# Altium schematic sheet insulation-monitoring.SchDoc
size A3; DocumentNumber: 18; SheetNumber: 18; SheetTotal: 45; SheetDescription: Insulation Monitoring Interface
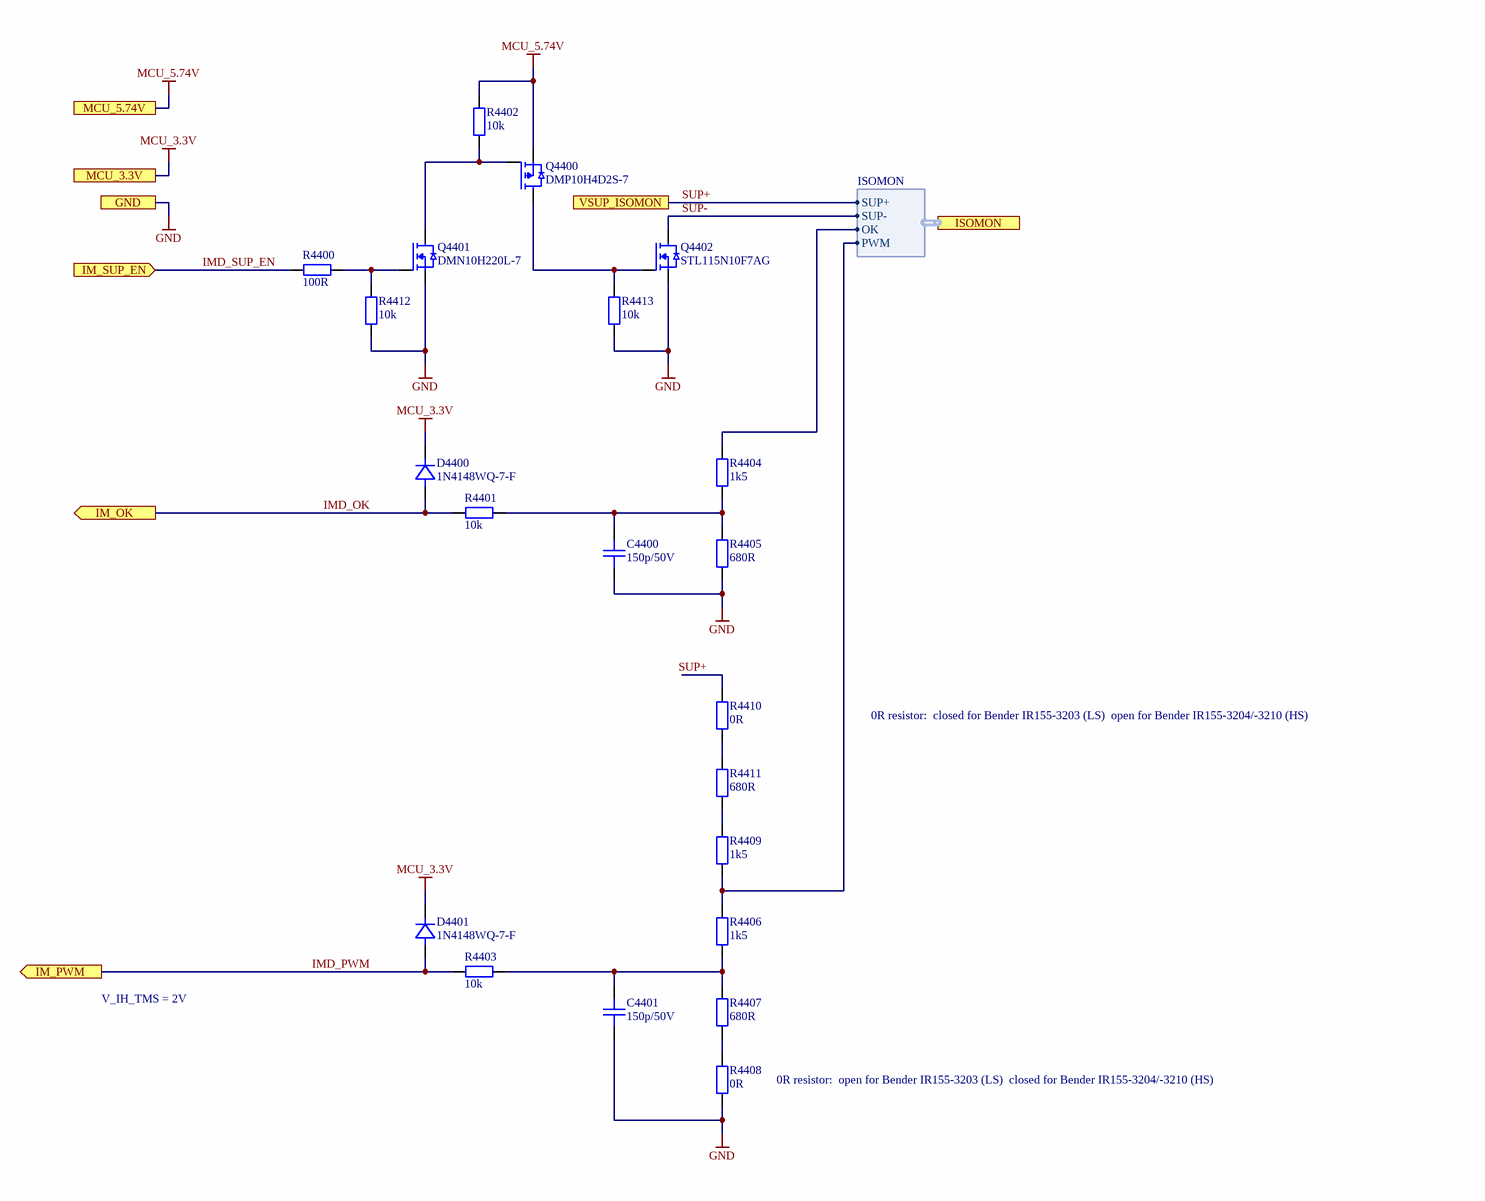
[diagram p0: insulation-monitoring.SchDoc]

## Parts
C4400  150p/50V  [CAPC1005X06N]
C4401  150p/50V  [CAPC1005X06N]
D4400  1N4148WQ-7-F  [SOD-123_CASE-425-04-ISSUE-G]
D4401  1N4148WQ-7-F  [SOD-123_CASE-425-04-ISSUE-G]
Q4400  DMP10H4D2S-7  [SOT95P237X110-3N]
Q4401  DMN10H220L-7  [SOT95P237X110-3N]
Q4402  STL115N10F7AG  [ST_PowerFLAT_5x6_WF_type_C]
R4400  100R  [RESC1005X04N]
R4401  10k  [RESC1005X04N]
R4402  10k  [RESC1005X04N]
R4403  10k  [RESC1005X04N]
R4404  1k5  [RESC1005X04N]
R4405  680R  [RESC1005X04N]
R4406  1k5  [RESC1005X04N]
R4407  680R  [RESC1005X04N]
R4408  0R  [RESC1005X04N]
R4409  1k5  [RESC1005X04N]
R4410  0R  [RESC1005X04N]
R4411  680R  [RESC1005X04N]
R4412  10k  [RESC1005X04N]
R4413  10k  [RESC1005X04N]

## Ports
GND, IM_OK (out), IM_PWM (out), IM_SUP_EN (in), ISOMON (harness ISOMON), MCU_3.3V, MCU_5.74V, VSUP_ISOMON

## Harnesses
ISOMON: SUP+, SUP-, OK, PWM

## Nets
GND: C4400.1 C4401.1 Q4401.S Q4402.S R4405.1 R4408.1 R4412.1 R4413.1 ; port GND
MCU_3.3V: D4400.1(K) D4401.1(K) ; port MCU_3.3V
MCU_5.74V: Q4400.S R4402.2 ; port MCU_5.74V
IMD_OK: D4400.2(A) R4401.2 ; port IM_OK
IMD_PWM: D4401.2(A) R4403.2 ; port IM_PWM
IMD_SUP_EN: R4400.1 ; port IM_SUP_EN
SUP+: R4410.2 ; port VSUP_ISOMON, port ISOMON.SUP+
SUP-: Q4402.D ; port ISOMON.SUP-
NetC4400_2: C4400.2 R4401.1 R4404.1 R4405.2
NetC4401_2: C4401.2 R4403.1 R4406.1 R4407.2
NetQ4400_D: Q4400.D Q4402.G R4413.2
NetQ4400_G: Q4400.G Q4401.D R4402.1
NetQ4401_G: Q4401.G R4400.2 R4412.2
NetR4404_2: R4404.2 ; port ISOMON.OK
NetR4406_2: R4406.2 R4409.1 ; port ISOMON.PWM
NetR4407_1: R4407.1 R4408.2
NetR4409_2: R4409.2 R4411.2
NetR4410_1: R4410.1 R4411.1

## Notes on the sheet
- 0R resistor:
  closed for Bender IR155-3203 (LS)
  open for Bender IR155-3204/-3210 (HS)
- V_IH_TMS = 2V
- 0R resistor:
  open for Bender IR155-3203 (LS)
  closed for Bender IR155-3204/-3210 (HS)
- Fraunhofer IISB
- Schottkystr. 10
- developed by:
- 91058 Erlangen
- Germany
- Author
- Project
- License
- Description
- File
- Version
- Release Date
- Sheet
- foxbms.org <https://foxbms.org>
- www.iisb.fraunhofer.de <https://www.iisb.fraunhofer.de/>
- foxBMS Team
- /

## Library data of the parts
C4400 C4401 = gen_C_ceramic_150p_50V_C0G_0402: MLCC; Capacitance: 150p; Rated Voltage: 50V; Dielectric: C0G; Case EIA: 0402; Case Metric: 1005; Automotive Qualified: True; PnP Package: 0402C; Part Number: gen_C_ceramic_150p_50V_C0G_0402; Supplier 1: Digikey; Supplier Part Number 1: 490-4926-1-ND
D4400 D4401 = 1N4148WQ-7-F: Diode; Manufacturer: Diodes Inc.; Breakdown Voltage: 100V; Continuous Forward Current: 300mA; PnP Package: SOD123; Automotive Qualified: True; Part Number: 1N4148WQ-7-F; Part Name: 1N4148WQ-7-F; Operating Temperature: -65°C - +150°C; ComponentLink1Description: Datasheet; ComponentLink1URL: https://www.diodes.com/assets/Datasheets/ds30086.pdf; Supplier 1: Digikey; Supplier Part Number 1: 1N4148WQ-7-FDICT-ND
Q4400 = DMP10H4D2S-7: MOSFET-Transistor, p-Kanal, 0.27 A, 100 V, 4.2 ohm; Manufacturer: Diodes; Maximum Drain-Source Voltage: 100V; Maximum Continous Drain Current (25°C): 0.27A; R_DS(on): 4.2; Total Gate Charge: 1.8nC; Automotive Qualified: True; Part Number: DMP10H4D2S-7; Part Name: PMOS; Operating Temperature: -55°C - +150°C; ComponentLink1Description: Datasheet; ComponentLink1URL: https://www.diodes.com/assets/Datasheets/DMP10H4D2S.pdf; Supplier 1: Farnell; Supplier Part Number 1: 3127354; Supplier 2: Digikey; Supplier Part Number 2: DMP10H4D2S-7DICT-ND; Supplier 3: Mouser; Supplier Part Number 3: 621-DMP10H4D2S-7
Q4401 = DMN10H220L-7: MOSFET-Transistor, n-Kanal, 1.6 A, 100 V, 0.250 ohm; Manufacturer: Diodes; Maximum Drain-Source Voltage: 100V; Maximum Continous Drain Current (25°C): 1.6A; R_DS(on): 250m; Total Gate Charge: 4.1nC; Automotive Qualified: True; Part Number: DMN10H220L-7; Part Name: NMOS; Operating Temperature: -55°C - +150°C; ComponentLink1Description: Datasheet; ComponentLink1URL: https://www.diodes.com/assets/Datasheets/DMN10H220L.pdf; Supplier 1: Digikey; Supplier Part Number 1: DMN10H220L-7DICT-ND; Supplier 2: Farnell; Supplier 3: Mouser; Supplier Part Number 2: 3127326; Supplier Part Number 3: 621-DMN10H220L-7
Q4402 = STL115N10F7AG: N-Channel MOSFET, 100 V, 107 A, 5 mOhm; Manufacturer: STMicroelectronics; Maximum Drain-Source Voltage: 100V; Maximum Continous Drain Current (25°C): 107A; R_DS(on): 5m; Total Gate Charge: 72.5nC; Automotive Qualified: True; AEC-Q Norm: AEC-Q101; AEC-Q Grade: Grade 0; Part Number: STL115N10F7AG; Part Name: NMOS; Operating Temperature: -55°C - +175°C; ComponentLink1Description: Datasheet; ComponentLink1URL: https://www.mouser.de/datasheet/2/389/dm00333356-1798814.pdf; Supplier 1: Mouser; Supplier Part Number 1: 511-STL115N10F7AG; Supplier 2: Digikey; Supplier Part Number 2: 497-17622-1-ND; ECCN: EAR99
R4400 = gen_R_100R_0402: SMD Resistor 100R 0402; Tolerance: 1%; Power: 0.063W; Case EIA: 0402; Case Metric: 1005; Maximum Working Voltage: 50V; PnP Package: 0402R; PnP equipped: x; Automotive Qualified: True; AEC-Q Norm: AEC-Q200; Part Number: gen_R_100R_0402; Operating Temperature: -55°C - +155°C; Resistance: 100R; Series: E24, E96; PnP Value: 100R; Supplier 1: Farnell; Supplier Part Number 1: 2302528; ECCN: EAR99
R4401-R4403 R4412 R4413 = gen_R_10k_0402: SMD Resistor 10k 0402; Tolerance: 1%; Power: 0.063W; Case EIA: 0402; Case Metric: 1005; Maximum Working Voltage: 50V; PnP Package: 0402R; PnP equipped: x; Automotive Qualified: True; AEC-Q Norm: AEC-Q200; Part Number: gen_R_10k_0402; Operating Temperature: -55°C - +155°C; Resistance: 10k; Series: E24, E96; PnP Value: 10k; Supplier 1: Farnell; Supplier Part Number 1: 2059239; ECCN: EAR99
R4404 R4406 R4409 = gen_R_1k5_0402: SMD Resistor 1k5 0402; Tolerance: 1%; Power: 0.063W; Case EIA: 0402; Case Metric: 1005; Maximum Working Voltage: 50V; PnP Package: 0402R; Automotive Qualified: True; Part Number: gen_R_1k5_0402; Operating Temperature: -55°C - +155°C; Resistance: 1k5; Series: E24, E96; PnP Value: 1k5; Supplier 1: Farnell; Supplier Part Number 1: 2302656; Supplier 2: Farnell; Supplier Part Number 2: 1653201
R4405 R4407 R4411 = gen_R_680R_0402: SMD Resistor 680R 0402; Tolerance: 1%; Power: 0.063W; Case EIA: 0402; Case Metric: 1005; Maximum Working Voltage: 50V; PnP Package: 0402R; Automotive Qualified: True; AEC-Q Grade: Grade 0; AEC-Q Norm: AEC-Q200; Part Number: gen_R_680R_0402; Operating Temperature: -55°C - +155°C; Resistance: 680R; Series: E24; PnP Value: 680R; ECCN: EAR99; Supplier 1: Farnell; Supplier Part Number 1: 2302619
R4408 R4410 = gen_R_0R_0402: SMD Resistor 0R 0402; Power: 0.063W; Case EIA: 0402; Case Metric: 1005; PnP Package: 0402R; Maximum Working Voltage: 50V; Automotive Qualified: True; AEC-Q Norm: AEC-Q200; PnP equipped: x; Part Number: gen_R_0R_0402; Operating Temperature: -55°C - +155°C; Resistance: 0R; Series: Jumper; PnP Value: 0R; Supplier 1: Farnell; Supplier Part Number 1: 1469661; Supplier 2: Farnell; Supplier Part Number 2: 2059190; ECCN: EAR99